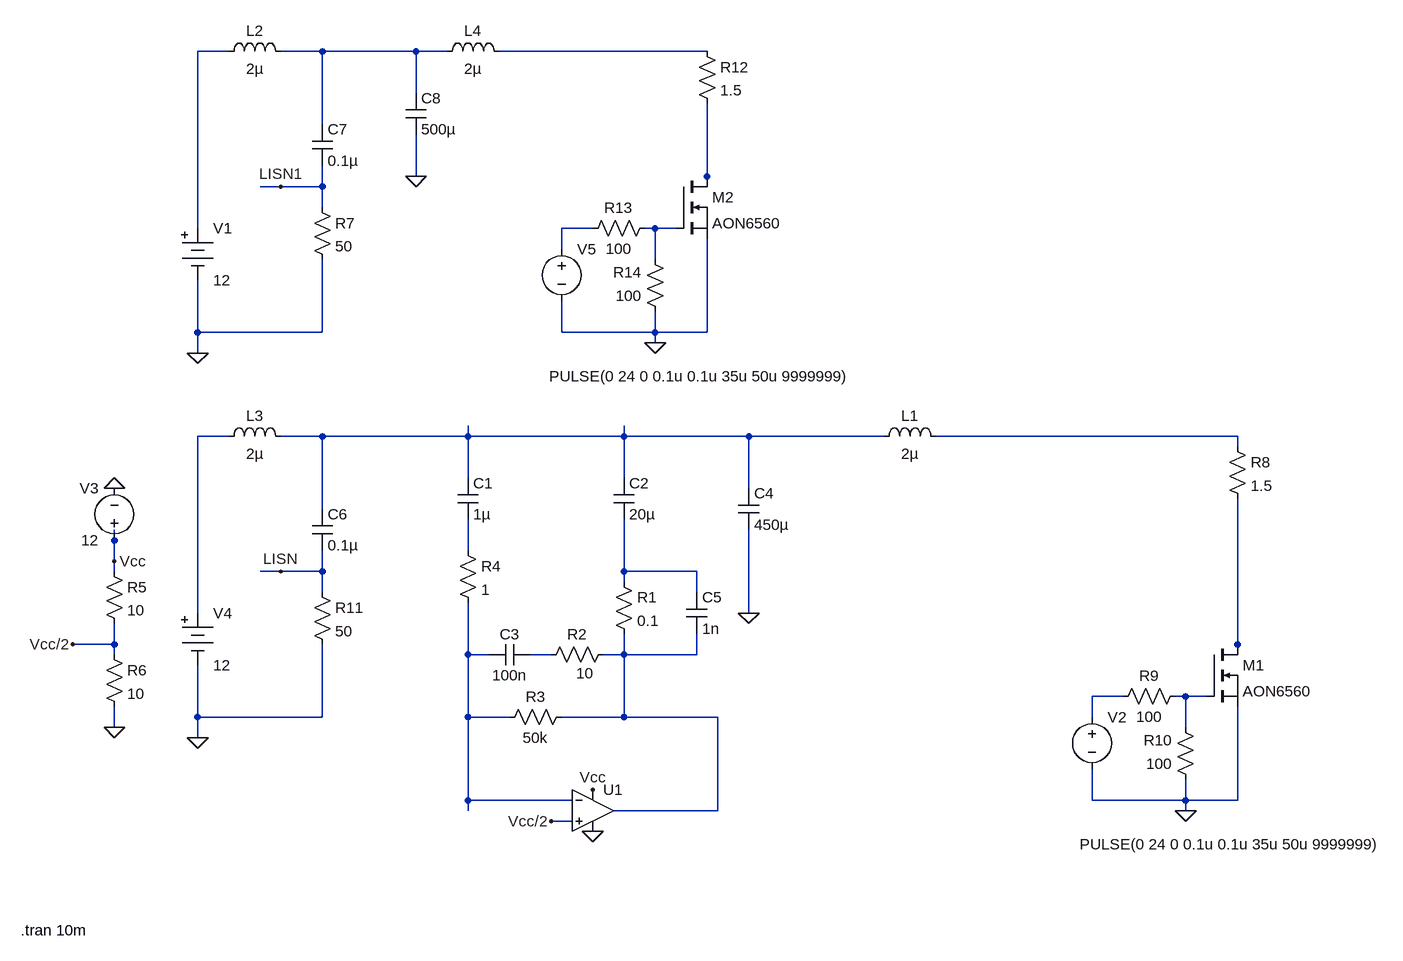
[diagram p0: schematic AEF_20kHz.asc]
AEF_20kHz.asc, the LTspice schematic file:
Version 4
SHEET 1 3444 680
WIRE -336 -720 -384 -720
WIRE -192 -720 -256 -720
WIRE -48 -720 -192 -720
WIRE 0 -720 -48 -720
WIRE 400 -720 80 -720
WIRE -48 -656 -48 -720
WIRE -192 -608 -192 -720
WIRE -48 -528 -48 -592
WIRE 400 -528 400 -640
WIRE -256 -512 -288 -512
WIRE -192 -512 -192 -544
WIRE -192 -512 -256 -512
WIRE 400 -512 400 -528
WIRE -192 -480 -192 -512
WIRE -384 -448 -384 -720
WIRE 224 -448 176 -448
WIRE 320 -448 304 -448
WIRE 352 -448 320 -448
WIRE 176 -416 176 -448
WIRE 320 -400 320 -448
WIRE -384 -288 -384 -368
WIRE -192 -288 -192 -400
WIRE -192 -288 -384 -288
WIRE 176 -288 176 -336
WIRE 320 -288 320 -320
WIRE 320 -288 176 -288
WIRE 400 -288 400 -432
WIRE 400 -288 320 -288
WIRE 320 -272 320 -288
WIRE -384 -256 -384 -288
WIRE -336 -128 -384 -128
WIRE -192 -128 -256 -128
WIRE 32 -128 32 -144
WIRE 32 -128 -192 -128
WIRE 272 -128 272 -144
WIRE 272 -128 32 -128
WIRE 464 -128 272 -128
WIRE 672 -128 464 -128
WIRE 1216 -128 752 -128
WIRE 1216 -112 1216 -128
WIRE 32 -64 32 -128
WIRE 272 -64 272 -128
WIRE 464 -48 464 -128
WIRE -192 -16 -192 -128
WIRE -512 32 -512 16
WIRE 32 48 32 0
WIRE -512 64 -512 32
WIRE -512 80 -512 64
WIRE -256 80 -288 80
WIRE -192 80 -192 48
WIRE -192 80 -256 80
WIRE 272 80 272 0
WIRE 384 80 272 80
WIRE 272 96 272 80
WIRE -192 112 -192 80
WIRE 384 112 384 80
WIRE -384 144 -384 -128
WIRE 464 144 464 16
WIRE -512 192 -512 160
WIRE -512 192 -576 192
WIRE 1216 192 1216 -32
WIRE -512 208 -512 192
WIRE 32 208 32 128
WIRE 64 208 32 208
WIRE 160 208 128 208
WIRE 272 208 272 176
WIRE 272 208 240 208
WIRE 384 208 384 176
WIRE 384 208 272 208
WIRE 1216 208 1216 192
WIRE 1040 272 992 272
WIRE 1136 272 1120 272
WIRE 1168 272 1136 272
WIRE -384 304 -384 224
WIRE -192 304 -192 192
WIRE -192 304 -384 304
WIRE 32 304 32 208
WIRE 96 304 32 304
WIRE 272 304 272 208
WIRE 272 304 176 304
WIRE 416 304 272 304
WIRE 992 304 992 272
WIRE -512 320 -512 288
WIRE 1136 320 1136 272
WIRE -384 336 -384 304
WIRE 32 432 32 304
WIRE 192 432 32 432
WIRE 992 432 992 384
WIRE 1136 432 1136 400
WIRE 1136 432 992 432
WIRE 1216 432 1216 288
WIRE 1216 432 1136 432
WIRE 32 448 32 432
WIRE 416 448 416 304
WIRE 416 448 256 448
WIRE 1136 448 1136 432
WIRE 192 464 160 464
FLAG -384 336 0
FLAG -576 192 Vcc/2
FLAG -512 320 0
FLAG -512 64 Vcc
FLAG 224 416 Vcc
FLAG 160 464 Vcc/2
FLAG 224 480 0
FLAG 1136 448 0
FLAG -512 -48 0
FLAG -256 80 LISN
FLAG 464 144 0
FLAG -384 -256 0
FLAG -256 -512 LISN1
FLAG 320 -272 0
FLAG -48 -528 0
DATAFLAG 128 -128 ""
DATAFLAG 32 368 ""
DATAFLAG 32 368 ""
DATAFLAG 416 336 ""
SYMBOL cap 16 -64 R0
SYMATTR InstName C1
SYMATTR Value 1µ
SYMBOL cap 256 -64 R0
SYMATTR InstName C2
SYMATTR Value 20µ
SYMBOL res 256 80 R0
SYMATTR InstName R1
SYMATTR Value 0.1
SYMBOL cap 128 192 R90
WINDOW 0 0 32 VBottom 2
WINDOW 3 32 32 VTop 2
SYMATTR InstName C3
SYMATTR Value 100n
SYMBOL res 256 192 R90
WINDOW 0 0 56 VBottom 2
WINDOW 3 29 44 VTop 2
SYMATTR InstName R2
SYMATTR Value 10
SYMBOL res 192 288 R90
WINDOW 0 0 56 VBottom 2
WINDOW 3 32 56 VTop 2
SYMATTR InstName R3
SYMATTR Value 50k
SYMBOL res -528 64 R0
SYMATTR InstName R5
SYMATTR Value 10
SYMBOL res -528 192 R0
SYMATTR InstName R6
SYMATTR Value 10
SYMBOL res 16 32 R0
SYMATTR InstName R4
SYMATTR Value 1
SYMBOL res 1200 -128 R0
SYMATTR InstName R8
SYMATTR Value 1.5
SYMBOL nmos 1168 192 R0
SYMATTR InstName M1
SYMATTR Value AON6560
SYMBOL res 1136 256 R90
WINDOW 0 0 56 VBottom 2
WINDOW 3 32 56 VTop 2
SYMATTR InstName R9
SYMATTR Value 100
SYMBOL res 1152 416 R180
WINDOW 0 36 76 Left 2
WINDOW 3 36 40 Left 2
SYMATTR InstName R10
SYMATTR Value 100
SYMBOL voltage 992 288 R0
WINDOW 3 -19 212 Left 2
WINDOW 123 0 0 Left 0
WINDOW 39 0 0 Left 0
SYMATTR Value PULSE(0 24 0 0.1u 0.1u 35u 50u 9999999)
SYMATTR InstName V2
SYMBOL voltage -512 48 R180
WINDOW 0 24 96 Left 2
WINDOW 3 24 16 Left 2
WINDOW 123 0 0 Left 0
WINDOW 39 0 0 Left 0
SYMATTR InstName V3
SYMATTR Value 12
SYMBOL ind -352 -112 R270
WINDOW 0 32 56 VTop 2
WINDOW 3 5 56 VBottom 2
SYMATTR InstName L3
SYMATTR Value 2µ
SYMBOL cap -208 -16 R0
SYMATTR InstName C6
SYMATTR Value 0.1µ
SYMBOL res -208 96 R0
SYMATTR InstName R11
SYMATTR Value 50
SYMBOL Misc\\battery -384 128 R0
WINDOW 123 0 0 Left 0
WINDOW 39 0 0 Left 0
SYMATTR InstName V4
SYMATTR Value 12
SYMBOL ind 656 -112 R270
WINDOW 0 32 56 VTop 2
WINDOW 3 5 56 VBottom 2
SYMATTR InstName L1
SYMATTR Value 2µ
SYMBOL cap 448 -48 R0
SYMATTR InstName C4
SYMATTR Value 450µ
SYMBOL cap 368 112 R0
SYMATTR InstName C5
SYMATTR Value 1n
SYMBOL ind -352 -704 R270
WINDOW 0 32 56 VTop 2
WINDOW 3 5 56 VBottom 2
SYMATTR InstName L2
SYMATTR Value 2µ
SYMBOL cap -208 -608 R0
SYMATTR InstName C7
SYMATTR Value 0.1µ
SYMBOL res -208 -496 R0
SYMATTR InstName R7
SYMATTR Value 50
SYMBOL Misc\\battery -384 -464 R0
WINDOW 123 0 0 Left 0
WINDOW 39 0 0 Left 0
SYMATTR InstName V1
SYMATTR Value 12
SYMBOL ind -16 -704 R270
WINDOW 0 32 56 VTop 2
WINDOW 3 5 56 VBottom 2
SYMATTR InstName L4
SYMATTR Value 2µ
SYMBOL res 384 -736 R0
SYMATTR InstName R12
SYMATTR Value 1.5
SYMBOL nmos 352 -528 R0
SYMATTR InstName M2
SYMATTR Value AON6560
SYMBOL res 320 -464 R90
WINDOW 0 0 56 VBottom 2
WINDOW 3 32 56 VTop 2
SYMATTR InstName R13
SYMATTR Value 100
SYMBOL res 336 -304 R180
WINDOW 0 36 76 Left 2
WINDOW 3 36 40 Left 2
SYMATTR InstName R14
SYMATTR Value 100
SYMBOL voltage 176 -432 R0
WINDOW 3 -19 212 Left 2
WINDOW 123 0 0 Left 0
WINDOW 39 0 0 Left 0
SYMATTR Value PULSE(0 24 0 0.1u 0.1u 35u 50u 9999999)
SYMATTR InstName V5
SYMBOL cap -64 -656 R0
SYMATTR InstName C8
SYMATTR Value 500µ
SYMBOL OpAmps\\UniversalOpamp2 224 448 R0
SYMATTR InstName U1
SYMATTR Value2 Avol=1Meg GBW=100Meg Slew=100Meg
SYMATTR SpiceLine ilimit=250m rail=0 Vos=0 phimargin=45
TEXT -656 632 Left 2 !.tran 10m

The netlist it stands for:
* AEF_20kHz.asc
C1 N008 N010 1µ
C2 N008 N011 20µ
R1 N011 N015 0.1
C3 N014 N013 100n
R2 N015 N014 10
R3 N015 N013 50k
R5 Vcc Vcc/2 10
R6 Vcc/2 0 10
R4 N010 N013 1
R8 N009 N012 1.5
M1 N012 N017 0 0 AON6560
R9 N017 N016 100
R10 0 N017 100
V2 N016 0 PULSE(0 24 0 0.1u 0.1u 35u 50u 9999999)
V3 Vcc 0 12
L3 N007 N008 2µ
C6 N008 LISN 0.1µ
R11 LISN 0 50
V4 N007 0 12
L1 N008 N009 2µ
C4 N008 0 450µ
C5 N011 N015 1n
L2 N001 N002 2µ
C7 N002 LISN1 0.1µ
R7 LISN1 0 50
V1 N001 0 12
L4 N002 N003 2µ
R12 N003 N004 1.5
M2 N004 N006 0 0 AON6560
R13 N006 N005 100
R14 0 N006 100
V5 N005 0 PULSE(0 24 0 0.1u 0.1u 35u 50u 9999999)
C8 N002 0 500µ
XU1 Vcc/2 N013 Vcc 0 N015 level.2 Avol=1Meg GBW=100Meg Slew=100Meg ilimit=250m rail=0 Vos=0 phimargin=45 en=0 enk=0 in=0 ink=0 Rin=500Meg  ; pins IN+ IN- V+ V- OUT
.model NMOS NMOS
.model PMOS PMOS
.lib standard.mos
.tran 10m
.lib UniversalOpamps2.sub
.backanno
.end